# Altium schematic sheet top.SchDoc
size C; SheetNumber: 1
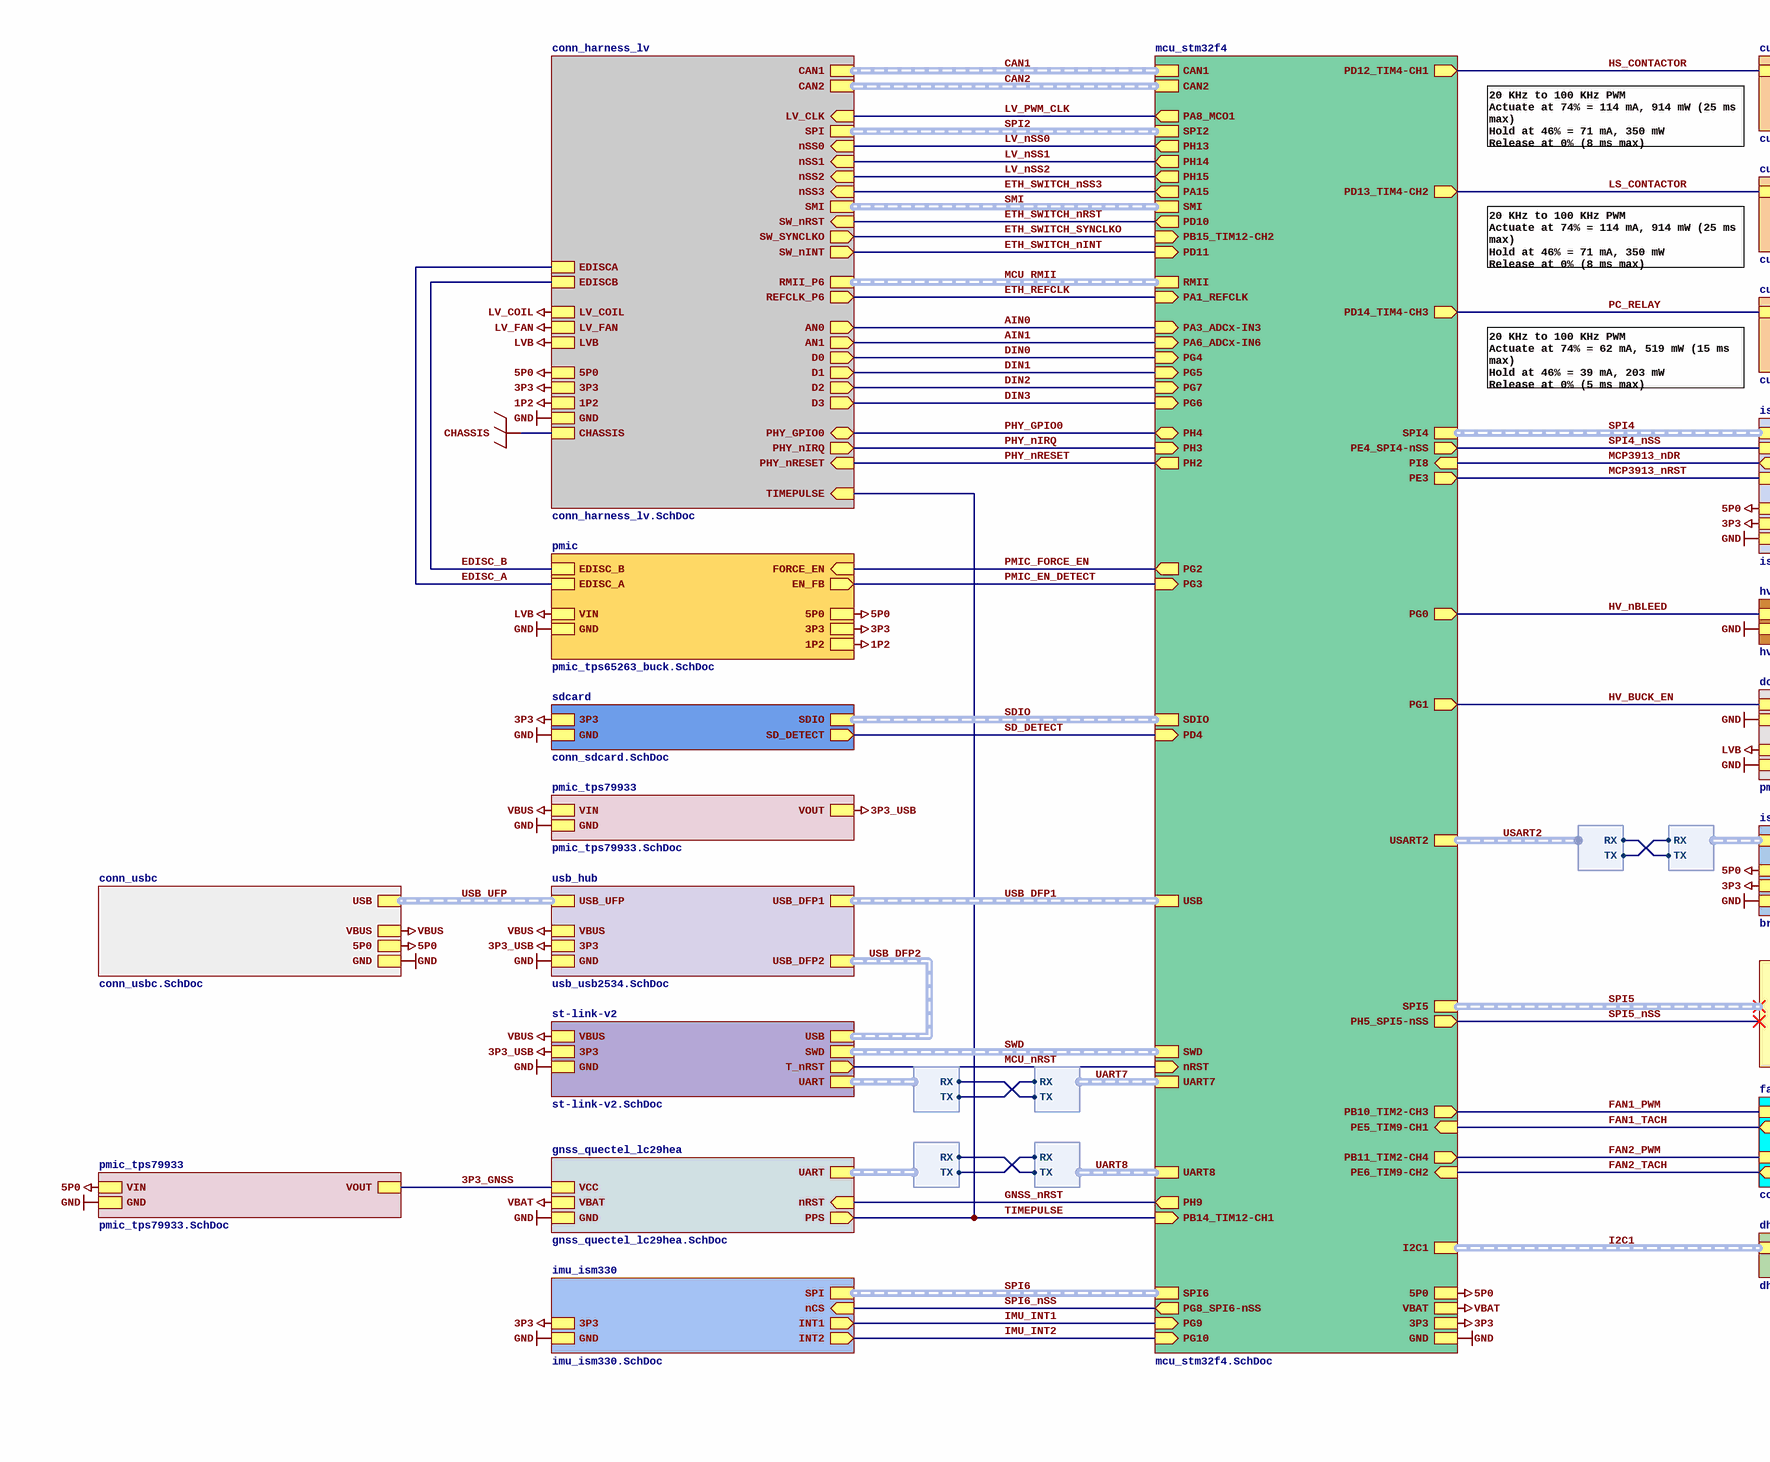
[diagram p0: top.SchDoc, left]
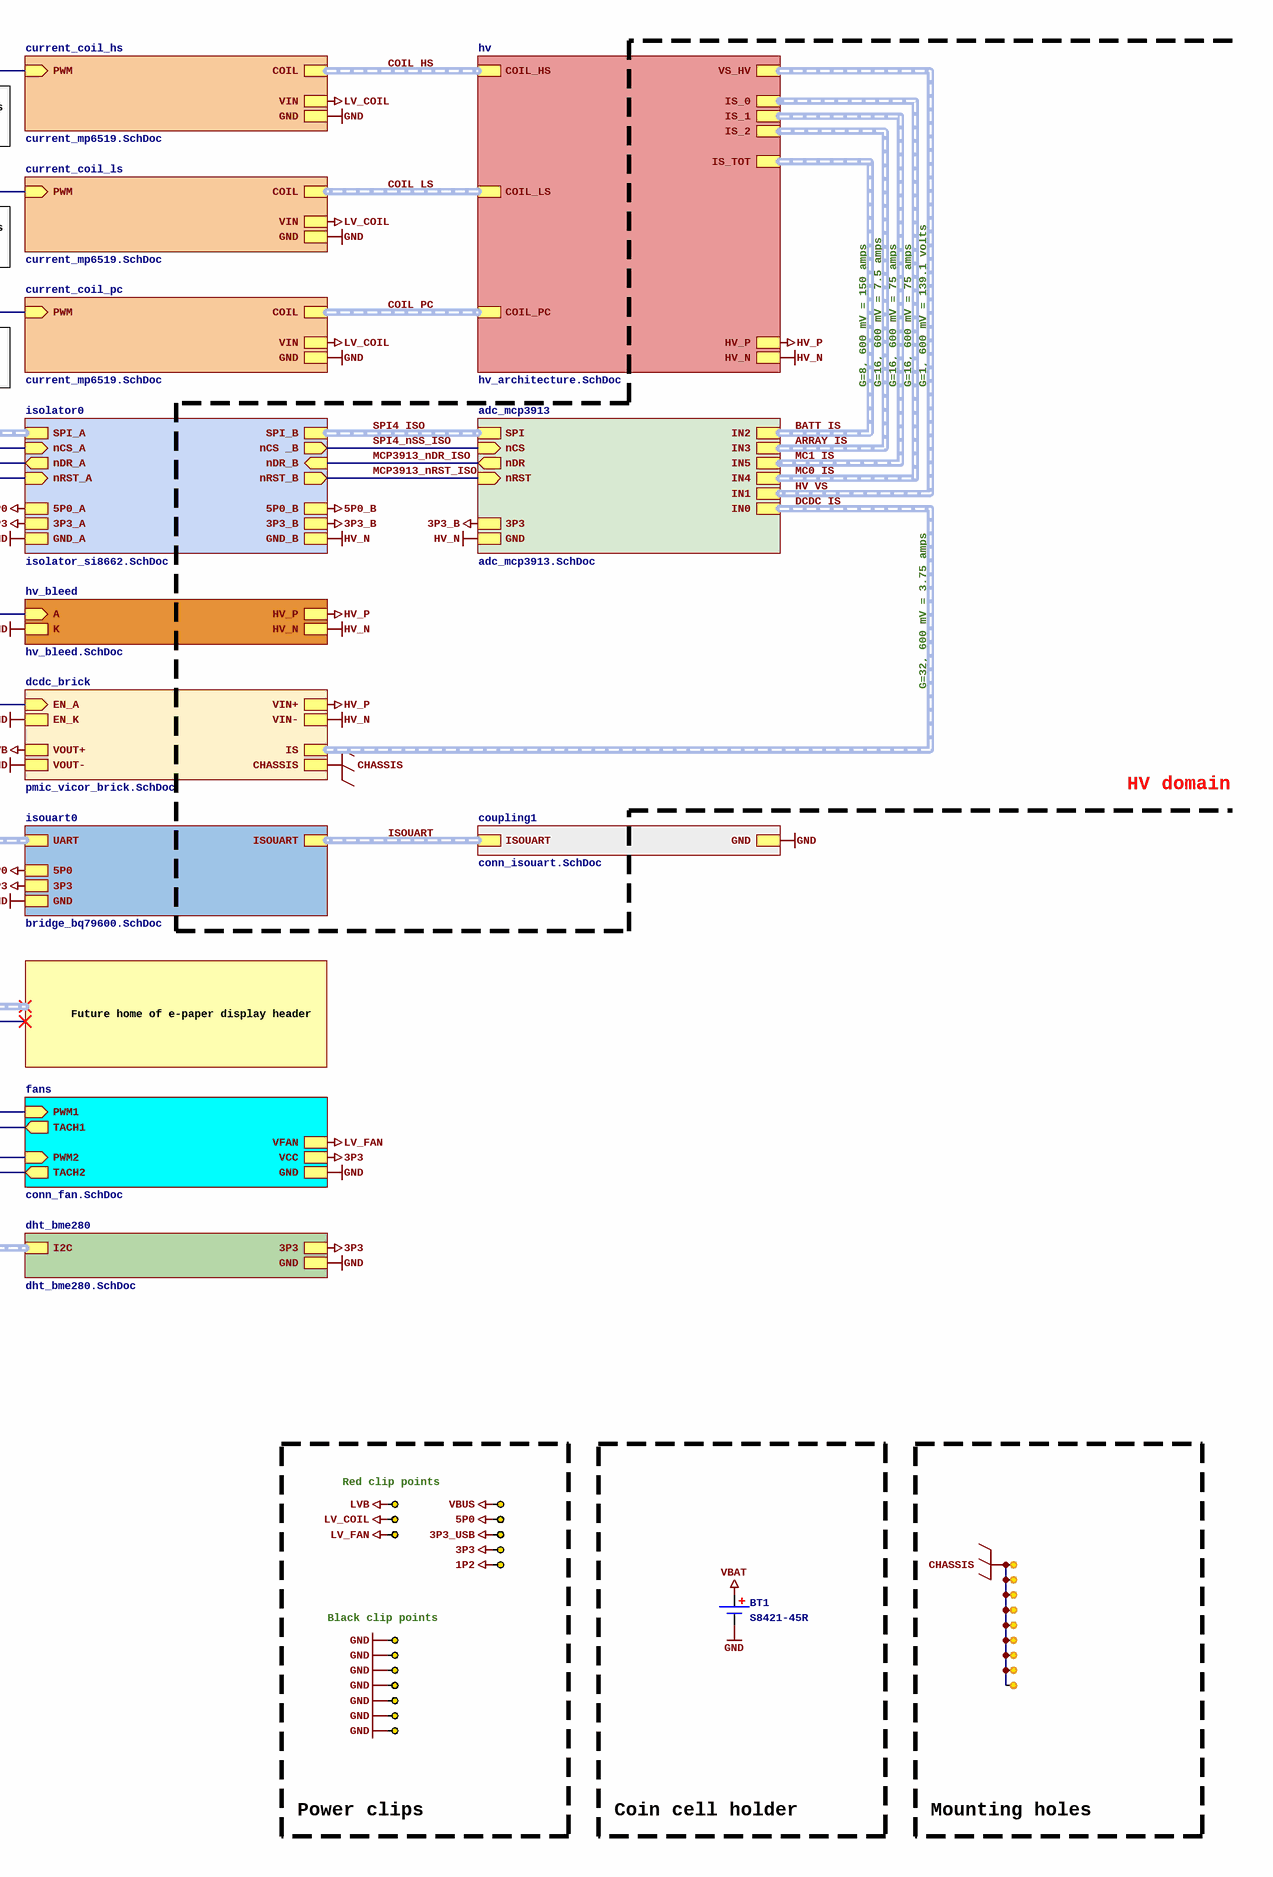
[diagram p1: top.SchDoc, right]

## Parts
BT1  S8421-45R  [HOLDER_BATT_CR2032_HARWIN_S8421-45R]
MH1  HOLE_M3  [HOLE_M3]  (value not drawn)  (no BOM)
MH2  HOLE_M3  [HOLE_M3]  (value not drawn)  (no BOM)
MH3  HOLE_M3  [HOLE_M3]  (value not drawn)  (no BOM)
MH4  HOLE_M3  [HOLE_M3]  (value not drawn)  (no BOM)
MH5  HOLE_M3  [HOLE_M3]  (value not drawn)  (no BOM)
MH6  HOLE_M3  [HOLE_M3]  (value not drawn)  (no BOM)
MH7  HOLE_M3  [HOLE_M3]  (value not drawn)  (no BOM)
MH8  HOLE_M3  [HOLE_M3]  (value not drawn)  (no BOM)
MH9  HOLE_M3  [HOLE_M3]  (value not drawn)  (no BOM)
TP32  RH-5000  [TP_RH-5000]  (value not drawn)
TP33  RH-5000  [TP_RH-5000]  (value not drawn)
TP34  RH-5000  [TP_RH-5000]  (value not drawn)
TP35  RH-5000  [TP_RH-5000]  (value not drawn)
TP36  RH-5000  [TP_RH-5000]  (value not drawn)
TP37  RH-5000  [TP_RH-5000]  (value not drawn)
TP39  RH-5001  [TP_RH-5001]  (value not drawn)
TP41  RH-5001  [TP_RH-5001]  (value not drawn)
TP43  RH-5001  [TP_RH-5001]  (value not drawn)
TP45  RH-5001  [TP_RH-5001]  (value not drawn)
TP46  RH-5001  [TP_RH-5001]  (value not drawn)
TP47  RH-5001  [TP_RH-5001]  (value not drawn)
TP48  RH-5001  [TP_RH-5001]  (value not drawn)
TP89  RH-5000  [TP_RH-5000]  (value not drawn)
TP90  RH-5000  [TP_RH-5000]  (value not drawn)

## Blocks framed on the sheet
Power clips: TP32-TP37 TP39 TP41 TP43 TP45-TP48 TP89 TP90
Coin cell holder: BT1
Mounting holes: MH1-MH9

## Sub-sheets
adc_mcp3913 = adc_mcp3913.SchDoc: IN0 (harness DIFF), IN1 (harness DIFF), IN2 (harness DIFF), IN3 (harness DIFF), IN4 (harness DIFF), IN5 (harness DIFF), SPI (harness SPI), 3P3, GND, nCS (in), nDR (out), nRST (in)
conn_harness_lv = conn_harness_lv.SchDoc: GND, 3P3, 5P0, SPI (harness SPI), AN0 (out), AN1 (out), nSS2 (in), nSS1 (in), nSS0 (in), SW_nRST (in), REFCLK_P6 (out), LV_CLK (in), EDISCA, EDISCB, D0 (out), D1 (out), D2 (out), D3 (out), CAN2 (harness CAN), CAN1 (harness CAN), SMI (harness SMI), RMII_P6 (harness RMII), LV_FAN, LV_COIL, 1P2, TIMEPULSE (in), LVB, CHASSIS, nSS3 (in), PHY_GPIO0 (bidir), PHY_nIRQ (out), PHY_nRESET (in), SW_SYNCLKO (out), SW_nINT (out)
conn_usbc = conn_usbc.SchDoc: 5P0, USB (harness DIFF), GND, VBUS
coupling1 = conn_isouart.SchDoc: ISOUART (harness DIFF), GND
current_coil_hs = current_mp6519.SchDoc: COIL (harness DIFF), VIN, PWM (in), GND
current_coil_ls = current_mp6519.SchDoc: COIL (harness DIFF), VIN, PWM (in), GND
current_coil_pc = current_mp6519.SchDoc: COIL (harness DIFF), VIN, PWM (in), GND
dcdc_brick = pmic_vicor_brick.SchDoc: EN_A (in), EN_K, VIN+, VIN-, VOUT+, VOUT-, IS (harness DIFF), CHASSIS
dht_bme280 = dht_bme280.SchDoc: I2C (harness I2C), GND, 3P3
fans = conn_fan.SchDoc: GND, VFAN, PWM1 (in), PWM2 (in), VCC, TACH1 (out), TACH2 (out)
gnss_quectel_lc29hea = gnss_quectel_lc29hea.SchDoc: GND, VCC, VBAT, PPS (out), nRST (in), UART (harness UART)
hv = hv_architecture.SchDoc: IS_0 (harness DIFF), IS_1 (harness DIFF), IS_2 (harness DIFF), IS_TOT (harness DIFF), COIL_HS (harness DIFF), COIL_LS (harness DIFF), COIL_PC (harness DIFF), HV_P, HV_N, VS_HV (harness DIFF)
hv_bleed = hv_bleed.SchDoc: A (in), K, HV_N, HV_P
imu_ism330 = imu_ism330.SchDoc: 3P3, GND, INT1 (out), INT2 (out), SPI (harness SPI), nCS (in)
isolator0 = isolator_si8662.SchDoc: SPI_A (harness SPI), nCS_A (in), nRST_A (in), nDR_A (out), SPI_B (harness SPI), nCS _B (out), nRST_B (out), nDR_B (in), 3P3_A, GND_A, 5P0_A, 3P3_B, GND_B, 5P0_B
isouart0 = bridge_bq79600.SchDoc: ISOUART (harness DIFF), GND, 3P3, UART (harness UART), 5P0
mcu_stm32f4 = mcu_stm32f4.SchDoc: GND, 3P3, CAN2 (harness CAN), SDIO (harness SDIO), CAN1 (harness CAN), VBAT, SPI4 (harness SPI), PA1_REFCLK (in), RMII (harness RMII), SMI (harness SMI), 5P0, PD12_TIM4-CH1 (out), PD13_TIM4-CH2 (out), USB (harness DIFF), SWD (harness SWD), UART7 (harness UART), nRST (in), SPI2 (harness SPI), PD14_TIM4-CH3 (out), PA3_ADCx-IN3 (in), PA6_ADCx-IN6 (in), PE4_SPI4-nSS (out), PE5_TIM9-CH1 (in), PE6_TIM9-CH2 (in), PB10_TIM2-CH3 (out), PB11_TIM2-CH4 (out), PA8_MCO1 (out), PD4 (in), PE3 (out), UART8 (harness UART), I2C1 (harness I2C), PB14_TIM12-CH1 (in), PH13 (out), PH14 (out), PH15 (out), PA15 (out), PH9 (out), PI8 (in), SPI5 (harness SPI), PH5_SPI5-nSS (out), PG0 (out), PG1 (out), PG4 (in), PG5 (in), PG6 (in), PG7 (in), PH3 (in), PH2 (out), PH4 (bidir), PG2 (out), PG3 (in), SPI6 (harness SPI), PG8_SPI6-nSS (out), PG9 (in), PG10 (in), PB15_TIM12-CH2 (in), PD11 (in), PD10 (out), USART2 (harness UART)
pmic = pmic_tps65263_buck.SchDoc: VIN, 5P0, GND, 3P3, 1P2, EDISC_A, EDISC_B, FORCE_EN (in), EN_FB (out)
pmic_tps79933 = pmic_tps79933.SchDoc: GND, VIN, VOUT
pmic_tps79933 = pmic_tps79933.SchDoc: GND, VIN, VOUT
sdcard = conn_sdcard.SchDoc: 3P3, GND, SD_DETECT (out), SDIO (harness SDIO)
st-link-v2 = st-link-v2.SchDoc: USB (harness DIFF), GND, 3P3, VBUS, SWD (harness SWD), T_nRST (out), UART (harness UART)
usb_hub = usb_usb2534.SchDoc: 3P3, GND, USB_DFP2 (harness DIFF), USB_DFP1 (harness DIFF), USB_UFP (harness DIFF), VBUS

## Harnesses
UART: RX, TX

## Nets
1P2: TP37.1 ; sheet pmic/1P2, sheet conn_harness_lv/1P2
3P3: TP35.1 ; sheet isouart0/3P3, sheet mcu_stm32f4/3P3, sheet pmic/3P3, sheet sdcard/3P3, sheet fans/VCC, sheet conn_harness_lv/3P3, sheet isolator0/3P3_A, sheet imu_ism330/3P3, sheet dht_bme280/3P3
3P3_B: sheet adc_mcp3913/3P3, sheet isolator0/3P3_B
3P3_USB: TP90.1 ; sheet usb_hub/3P3, sheet st-link-v2/3P3, sheet pmic_tps79933/VOUT
5P0: TP33.1 ; sheet isouart0/5P0, sheet mcu_stm32f4/5P0, sheet pmic/5P0, sheet conn_usbc/5P0, sheet conn_harness_lv/5P0, sheet isolator0/5P0_A, sheet pmic_tps79933/VIN
5P0_B: sheet isolator0/5P0_B
CHASSIS: MH1.0 MH2.0 MH3.0 MH4.0 MH5.0 MH6.0 MH7.0 MH8.0 MH9.0 ; sheet dcdc_brick/CHASSIS, sheet conn_harness_lv/CHASSIS
GND: BT1.2(-) TP39.1 TP41.1 TP43.1 TP45.1 TP46.1 TP47.1 TP48.1 ; sheet coupling1/GND, sheet isouart0/GND, sheet mcu_stm32f4/GND, sheet pmic/GND, sheet sdcard/GND, sheet fans/GND, sheet hv_bleed/K, sheet current_coil_hs/GND, sheet current_coil_ls/GND, sheet current_coil_pc/GND, sheet dcdc_brick/EN_K, sheet dcdc_brick/VOUT-, sheet usb_hub/GND, sheet conn_usbc/GND, sheet st-link-v2/GND, sheet conn_harness_lv/GND, sheet isolator0/GND_A, sheet pmic_tps79933/GND, sheet imu_ism330/GND, sheet dht_bme280/GND, sheet gnss_quectel_lc29hea/GND, sheet pmic_tps79933/GND
HV_N: sheet adc_mcp3913/GND, sheet hv/HV_N, sheet hv_bleed/HV_N, sheet dcdc_brick/VIN-, sheet isolator0/GND_B
HV_P: sheet hv/HV_P, sheet hv_bleed/HV_P, sheet dcdc_brick/VIN+
LV_COIL: TP34.1 ; sheet current_coil_hs/VIN, sheet current_coil_ls/VIN, sheet current_coil_pc/VIN, sheet conn_harness_lv/LV_COIL
LV_FAN: TP36.1 ; sheet fans/VFAN, sheet conn_harness_lv/LV_FAN
LVB: TP32.1 ; sheet pmic/VIN, sheet dcdc_brick/VOUT+, sheet conn_harness_lv/LVB
VBAT: BT1.1(+) ; sheet mcu_stm32f4/VBAT, sheet gnss_quectel_lc29hea/VBAT
VBUS: TP89.1 ; sheet usb_hub/VBUS, sheet conn_usbc/VBUS, sheet st-link-v2/VBUS, sheet pmic_tps79933/VIN
3P3_GNSS: sheet gnss_quectel_lc29hea/VCC, sheet pmic_tps79933/VOUT
AIN0: sheet mcu_stm32f4/PA3_ADCx-IN3, sheet conn_harness_lv/AN0
AIN1: sheet mcu_stm32f4/PA6_ADCx-IN6, sheet conn_harness_lv/AN1
DIN0: sheet mcu_stm32f4/PG4, sheet conn_harness_lv/D0
DIN1: sheet mcu_stm32f4/PG5, sheet conn_harness_lv/D1
DIN2: sheet mcu_stm32f4/PG7, sheet conn_harness_lv/D2
DIN3: sheet mcu_stm32f4/PG6, sheet conn_harness_lv/D3
EDISC_A: sheet pmic/EDISC_A, sheet conn_harness_lv/EDISCA
EDISC_B: sheet pmic/EDISC_B, sheet conn_harness_lv/EDISCB
ETH_REFCLK: sheet mcu_stm32f4/PA1_REFCLK, sheet conn_harness_lv/REFCLK_P6
ETH_SWITCH_nINT: sheet mcu_stm32f4/PD11, sheet conn_harness_lv/SW_nINT
ETH_SWITCH_nRST: sheet mcu_stm32f4/PD10, sheet conn_harness_lv/SW_nRST
ETH_SWITCH_nSS3: sheet mcu_stm32f4/PA15, sheet conn_harness_lv/nSS3
ETH_SWITCH_SYNCLKO: sheet mcu_stm32f4/PB15_TIM12-CH2, sheet conn_harness_lv/SW_SYNCLKO
FAN1_PWM: sheet mcu_stm32f4/PB10_TIM2-CH3, sheet fans/PWM1
FAN1_TACH: sheet mcu_stm32f4/PE5_TIM9-CH1, sheet fans/TACH1
FAN2_PWM: sheet mcu_stm32f4/PB11_TIM2-CH4, sheet fans/PWM2
FAN2_TACH: sheet mcu_stm32f4/PE6_TIM9-CH2, sheet fans/TACH2
GNSS_nRST: sheet mcu_stm32f4/PH9, sheet gnss_quectel_lc29hea/nRST
HS_CONTACTOR: sheet mcu_stm32f4/PD12_TIM4-CH1, sheet current_coil_hs/PWM
HV_BUCK_EN: sheet mcu_stm32f4/PG1, sheet dcdc_brick/EN_A
HV_nBLEED: sheet mcu_stm32f4/PG0, sheet hv_bleed/A
IMU_INT1: sheet mcu_stm32f4/PG9, sheet imu_ism330/INT1
IMU_INT2: sheet mcu_stm32f4/PG10, sheet imu_ism330/INT2
LS_CONTACTOR: sheet mcu_stm32f4/PD13_TIM4-CH2, sheet current_coil_ls/PWM
LV_nSS0: sheet mcu_stm32f4/PH13, sheet conn_harness_lv/nSS0
LV_nSS1: sheet mcu_stm32f4/PH14, sheet conn_harness_lv/nSS1
LV_nSS2: sheet mcu_stm32f4/PH15, sheet conn_harness_lv/nSS2
LV_PWM_CLK: sheet mcu_stm32f4/PA8_MCO1, sheet conn_harness_lv/LV_CLK
MCP3913_nDR: sheet mcu_stm32f4/PI8, sheet isolator0/nDR_A
MCP3913_nDR_ISO: sheet adc_mcp3913/nDR, sheet isolator0/nDR_B
MCP3913_nRST: sheet mcu_stm32f4/PE3, sheet isolator0/nRST_A
MCP3913_nRST_ISO: sheet adc_mcp3913/nRST, sheet isolator0/nRST_B
MCU_nRST: sheet mcu_stm32f4/nRST, sheet st-link-v2/T_nRST
PC_RELAY: sheet mcu_stm32f4/PD14_TIM4-CH3, sheet current_coil_pc/PWM
PHY_GPIO0: sheet mcu_stm32f4/PH4, sheet conn_harness_lv/PHY_GPIO0
PHY_nIRQ: sheet mcu_stm32f4/PH3, sheet conn_harness_lv/PHY_nIRQ
PHY_nRESET: sheet mcu_stm32f4/PH2, sheet conn_harness_lv/PHY_nRESET
PMIC_EN_DETECT: sheet mcu_stm32f4/PG3, sheet pmic/EN_FB
PMIC_FORCE_EN: sheet mcu_stm32f4/PG2, sheet pmic/FORCE_EN
SD_DETECT: sheet mcu_stm32f4/PD4, sheet sdcard/SD_DETECT
SPI4_nSS: sheet mcu_stm32f4/PE4_SPI4-nSS, sheet isolator0/nCS_A
SPI4_nSS_ISO: sheet adc_mcp3913/nCS, sheet isolator0/nCS _B
SPI5_nSS: sheet mcu_stm32f4/PH5_SPI5-nSS
SPI6_nSS: sheet mcu_stm32f4/PG8_SPI6-nSS, sheet imu_ism330/nCS
TIMEPULSE: sheet mcu_stm32f4/PB14_TIM12-CH1, sheet conn_harness_lv/TIMEPULSE, sheet gnss_quectel_lc29hea/PPS
UART7.RX: sheet st-link-v2/UART.TX, sheet mcu_stm32f4/UART7.RX
UART7.TX: sheet st-link-v2/UART.RX, sheet mcu_stm32f4/UART7.TX
UART8.RX: sheet gnss_quectel_lc29hea/UART.TX, sheet mcu_stm32f4/UART8.RX
UART8.TX: sheet gnss_quectel_lc29hea/UART.RX, sheet mcu_stm32f4/UART8.TX
USART2.RX: sheet mcu_stm32f4/USART2.RX, sheet isouart0/UART.TX
USART2.TX: sheet mcu_stm32f4/USART2.TX, sheet isouart0/UART.RX

## Buses and harness runs
harness ARRAY_IS = sheet adc_mcp3913/IN3 = sheet hv/IS_2
harness BATT_IS = sheet adc_mcp3913/IN2 = sheet hv/IS_TOT
harness CAN1 = sheet conn_harness_lv/CAN1 = sheet mcu_stm32f4/CAN1
harness CAN2 = sheet conn_harness_lv/CAN2 = sheet mcu_stm32f4/CAN2
harness COIL_HS = sheet current_coil_hs/COIL = sheet hv/COIL_HS
harness COIL_LS = sheet current_coil_ls/COIL = sheet hv/COIL_LS
harness COIL_PC = sheet current_coil_pc/COIL = sheet hv/COIL_PC
harness DCDC_IS = sheet adc_mcp3913/IN0 = sheet dcdc_brick/IS
harness HV_VS = sheet adc_mcp3913/IN1 = sheet hv/VS_HV
harness I2C1 = sheet dht_bme280/I2C = sheet mcu_stm32f4/I2C1
harness ISOUART = sheet coupling1/ISOUART = sheet isouart0/ISOUART
harness MC0_IS = sheet adc_mcp3913/IN4 = sheet hv/IS_0
harness MC1_IS = sheet adc_mcp3913/IN5 = sheet hv/IS_1
harness MCU_RMII = sheet conn_harness_lv/RMII_P6 = sheet mcu_stm32f4/RMII
harness SDIO = sheet mcu_stm32f4/SDIO = sheet sdcard/SDIO
harness SMI = sheet conn_harness_lv/SMI = sheet mcu_stm32f4/SMI
harness SPI2 = sheet conn_harness_lv/SPI = sheet mcu_stm32f4/SPI2
harness SPI4 = sheet isolator0/SPI_A = sheet mcu_stm32f4/SPI4
harness SPI4_ISO = sheet adc_mcp3913/SPI = sheet isolator0/SPI_B
harness SPI5 = sheet mcu_stm32f4/SPI5
harness SPI6 = sheet imu_ism330/SPI = sheet mcu_stm32f4/SPI6
harness SWD = sheet mcu_stm32f4/SWD = sheet st-link-v2/SWD
harness UART7 = sheet mcu_stm32f4/UART7
harness UART8 = sheet mcu_stm32f4/UART8
harness USART2 = sheet mcu_stm32f4/USART2
harness USB_DFP1 = sheet mcu_stm32f4/USB = sheet usb_hub/USB_DFP1
harness USB_DFP2 = sheet st-link-v2/USB = sheet usb_hub/USB_DFP2
harness USB_UFP = sheet conn_usbc/USB = sheet usb_hub/USB_UFP

## Notes on the sheet
- 20 KHz to 100 KHz PWM
  Actuate at 74% = 114 mA, 914 mW (25 ms max)
  Hold at 46% = 71 mA, 350 mW
  Release at 0% (8 ms max)
- 20 KHz to 100 KHz PWM
  Actuate at 74% = 62 mA, 519 mW (15 ms max)
  Hold at 46% = 39 mA, 203 mW
  Release at 0% (5 ms max)
- G=8, 600 mV = 150 amps
- G=16, 600 mV = 7.5 amps
- G=16, 600 mV = 75 amps
- G=1, 600 mV = 139.1 volts
- G=32, 600 mV = 3.75 amps
- HV domain
- Future home of e-paper display header
- (near TP32) Red clip points
- (near TP39) Black clip points

## Library data of the parts
BT1 = HOLDER_BATT_CR2032_HARWIN_S8421-45R: EZ-Coin Cell Battery Retainer, Horizontal SMT, for CR2032 Coin Cell Batteries; Manufacturer: Harwin; ComponentLink1URL: https://cdn.harwin.com/pdfs/S8421R.pdf; ComponentLink1Description: Datasheet; Supplier 1: Digikey; Supplier Part Number 1: 952-1737-1-ND; Manufacturer Part Number: S8421-45R; Supplier 2: LCSC; Supplier Part Number 2: C5185176
TP32-TP37 TP89 TP90 = RH-5000: Manufacturer: ronghe; ComponentLink1Description: Datasheet; ComponentLink1URL: https://datasheet.lcsc.com/lcsc/2307040929_ronghe-RH-5000_C5277086.pdf; Manufacturer Part Number: RH-5000; Supplier 2: LCSC; Supplier Part Number 2: C5277086
TP39 TP41 TP43 TP45-TP48 = RH-5001: Manufacturer: ronghe; ComponentLink1Description: Datasheet; ComponentLink1URL: https://datasheet.lcsc.com/lcsc/2307040929_ronghe-RH-5000_C5277086.pdf; Manufacturer Part Number: RH-5001; Supplier 2: LCSC; Supplier Part Number 2: C5199801